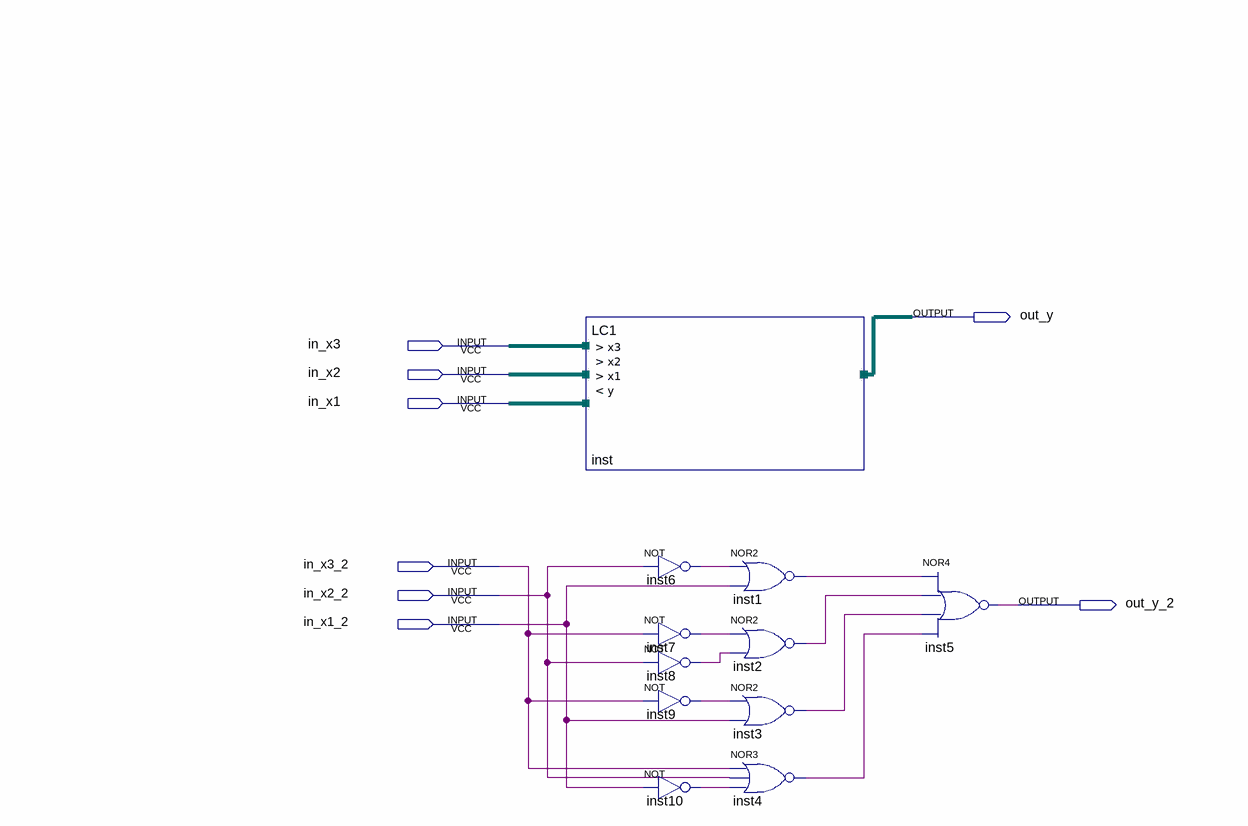
[diagram p0: schematic sheet]
// Quartus schematic CL_Lab1.bdf as structural Verilog: 11 symbols, 8 pins
module CL_Lab1 (
  input  in_x3,
  input  in_x2,
  input  in_x1,
  input  in_x3_2,
  input  in_x2_2,
  input  in_x1_2,
  output out_y,
  output out_y_2
);

  wire inst1_out, inst2_out, inst3_out, inst4_out, inst6_out, inst7_out, inst8_out, inst9_out, inst10_out;

  LC1 inst (.x3(in_x3), .x2(in_x2), .x1(in_x1), .y(out_y));
  not inst6 (inst6_out, in_x2_2);
  not inst7 (inst7_out, in_x3_2);
  not inst8 (inst8_out, in_x2_2);
  not inst9 (inst9_out, in_x3_2);
  not inst10 (inst10_out, in_x1_2);
  nor inst1 (inst1_out, inst6_out, in_x1_2);
  nor inst2 (inst2_out, inst7_out, inst8_out);
  nor inst3 (inst3_out, inst9_out, in_x1_2);
  nor inst4 (inst4_out, in_x3_2, in_x2_2, inst10_out);
  nor inst5 (out_y_2, inst1_out, inst2_out, inst3_out, inst4_out);
endmodule
